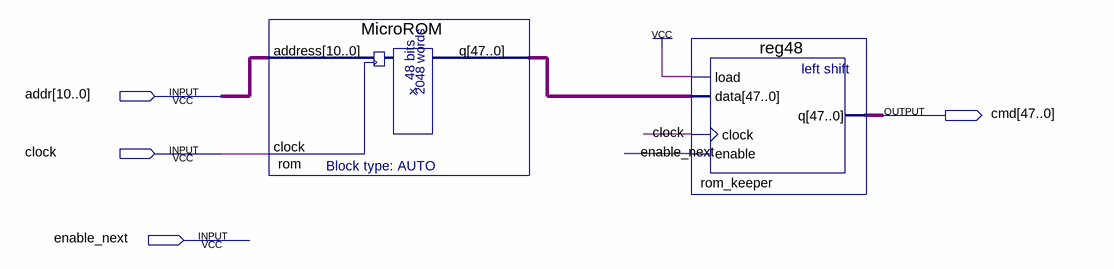
[diagram p0: schematic sheet]
// Quartus schematic MicroROMHolder.bdf as structural Verilog: 2 symbols, 4 pins
module MicroROMHolder (
  input  [10:0] addr,
  input  clock,
  input  enable_next,
  output [47:0] cmd
);

  wire [47:0] rom_q;

  MicroROM rom (.address(addr), .clock(clock), .q(rom_q));
  reg48 rom_keeper (.load(1'b1), .data(rom_q), .clock(clock), .enable(enable_next), .q(cmd));
endmodule
